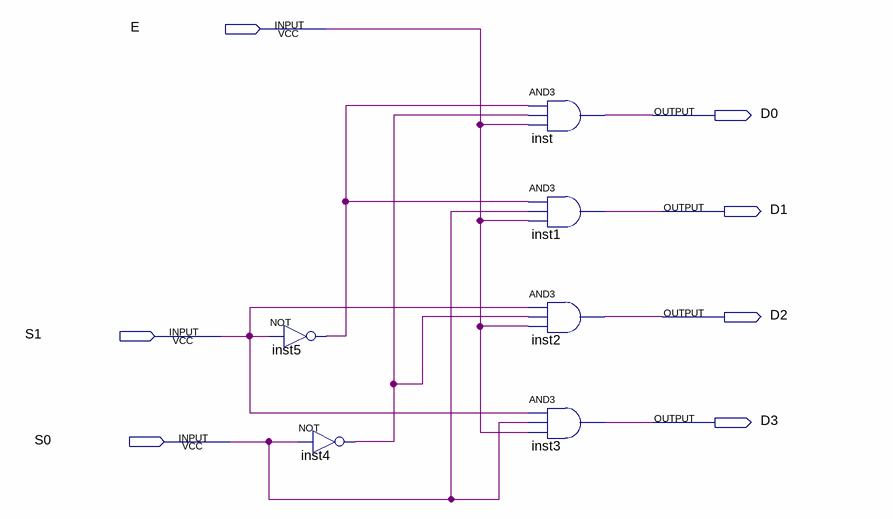
[diagram p0: schematic sheet]
// Quartus schematic dcd2-4.bdf as structural Verilog: 6 symbols, 7 pins
module \dcd2-4  (
  input  E,
  input  S1,
  input  S0,
  output D0,
  output D1,
  output D2,
  output D3
);

  wire inst4_out, inst5_out;

  not inst5 (inst5_out, S1);
  not inst4 (inst4_out, S0);
  and inst (D0, inst5_out, inst4_out, E);
  and inst1 (D1, inst5_out, S0, E);
  and inst2 (D2, S1, inst4_out, E);
  and inst3 (D3, S1, S0, E);
endmodule
